# Altium schematic sheet Individual_Band.SchDoc
size A; SheetNumber: 2; SheetTotal: 4
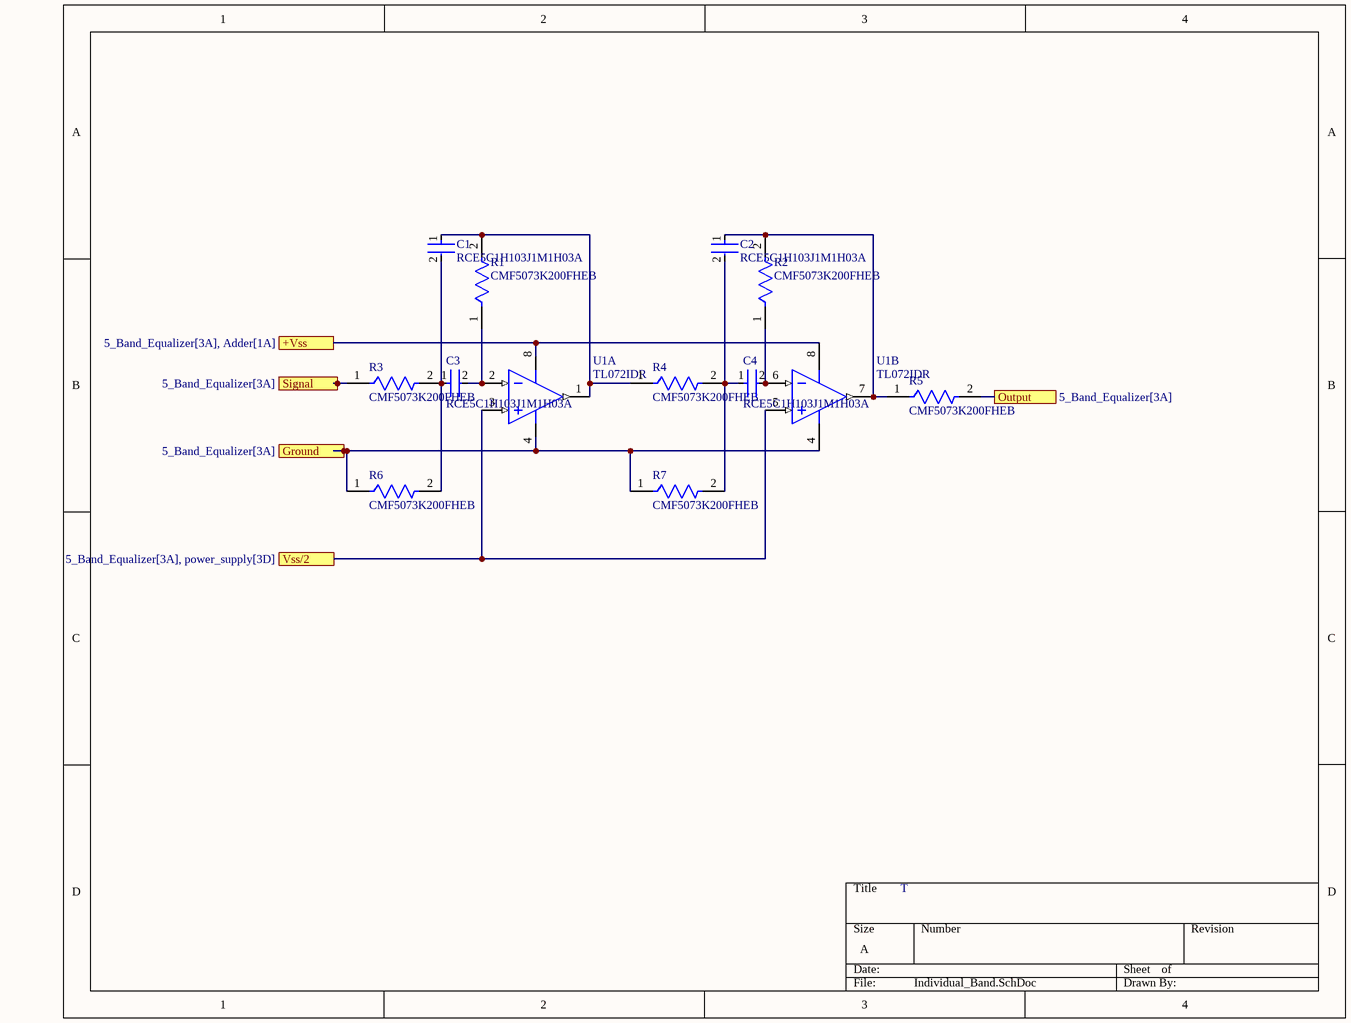
[diagram p0: Individual_Band.SchDoc]

## Parts
C1  RCE5C1H103J1M1H03A  [FP-RCE1K1-2_5-MFG]
C2  RCE5C1H103J1M1H03A  [FP-RCE1K1-2_5-MFG]
C3  RCE5C1H103J1M1H03A  [FP-RCE1K1-2_5-MFG]
C4  RCE5C1H103J1M1H03A  [FP-RCE1K1-2_5-MFG]
R1  CMF5073K200FHEB  [FP-CMF50-0]
R2  CMF5073K200FHEB  [FP-CMF50-0]
R3  CMF5073K200FHEB  [FP-CMF50-0]
R4  CMF5073K200FHEB  [FP-CMF50-0]
R5  CMF5073K200FHEB  [FP-CMF50-0]
R6  CMF5073K200FHEB  [FP-CMF50-0]
R7  CMF5073K200FHEB  [FP-CMF50-0]
U1  TL072IDR  [D0008A_L]  (parts A,B of 2)

## Ports
+Vss (see 5_Band_Equalizer[3A], Adder[1A]), Ground (see 5_Band_Equalizer[3A]), Output (see 5_Band_Equalizer[3A]), Signal (see 5_Band_Equalizer[3A]), Vss/2 (see 5_Band_Equalizer[3A], power_supply[3D])

## Nets
+Vss: U1.8(VCC+) ; port +Vss
Ground: R6.1 R7.1 U1.4(VCC-) ; port Ground
Output: R5.2 ; port Output
Signal: R3.1 ; port Signal
Vss/2: U1.3(IN1+) U1.5(IN2+) ; port Vss/2
NetC1_1: C1.1 R1.2 R4.1 U1.1(OUT1)
NetC1_2: C1.2 C3.1 R3.2 R6.2
NetC2_1: C2.1 R2.2 R5.1 U1.7(OUT2)
NetC2_2: C2.2 C4.1 R4.2 R7.2
NetC3_2: C3.2 R1.1 U1.2(IN1-)
NetC4_2: C4.2 R2.1 U1.6(IN2-)

## Notes on the sheet
- T

## Library data of the parts
C1-C4 = CMP-06035-061841-1: Cap Ceramic Monolithic 10nF 50V 5% Thru-Hole Bulk; Lead/Base Style: Formed Leads; Lead Diameter: 0.5mm; Dielectric: C0G; Height - Seated (Max): 0.138inch; Termination: Radial; Ratings: AEC-Q200; Width: 0.098inch; RoHS Compliant: Yes; Package Quantity: 2000; Voltage: 50V; Packaging: Tape and Reel; Voltage Rating (DC): 50V; Depth: 2.5mm; Tolerance: 5%; Voltage Rating: 50V; Length: 4mm; Capacitance: 10nF; Height: 3.5mm; Min Operating Temperature: -55°C; Max Operating Temperature: 125°C; Case/Package: Radial; Mount: Through Hole; Resistor Type: Ceramic; Lead Pitch: 0.197inch
R1-R7 = CMP-00030-44386654-1: CMF5073K200FHEB Res Metal Film 73.2K Ohm 1% 0.125W(1/8W) ±50ppm/°C Epoxy AXL T/R; Max Power Dissipation: 250mW; Voltage Rating: 200V; Power Rating: 125mW; Resistance: 73.2kΩ; Tolerance: 1%; Width: 1.65mm; Length: 3.81mm; Schedule B: 8533210090, 8533210090; Termination: Axial; Lead Free: Lead Free; Diameter: 1.65mm; Voltage Rating (DC): 200V; NexarPartId: 44386654; Packaging: Cut Tape; Max Operating Temperature: 175°C; Composition: Metal Film; RoHS: Compliant; Mount: Through Hole; Features: Flame Retardant Coating, Moisture Resistant; Number of Terminations: 2; Temperature Coefficient: 50ppm/°C; Min Operating Temperature: -55°C; Case/Package: Axial
U1 = CMP-0015-00084-2: Dual Low-Noise JFET-Input General-Purpose Operational Amplifier, 7 to 36 V, -40 to 85 degC, 8-pin SOIC (D8), Green (RoHS & no Sb/Br); Manufacturer: Texas Instruments; Number of Channels: 2; Rating: Catalog; IIB(Max)(pA): 200; Total Supply Voltage(Max)(+5V is 5, +/-5V is 10): 36; Vio (25C)(Max)(mV): 6; Iq per channel(Max)(mA): 2.5; Offset Drift(Typ)(uV/C): 18; Total Supply Voltage(Min)(+5V is 5, +/-5V is 10): 7; CMRR(Min)(dB): 75; Slew Rate(Typ)(V/us): 13; Sub Family: General Purpose Amplifier, High Supply Voltage Amplifier (>=30V); GBW(Typ)(MHz): 3; Code_JEDEC: MS-012; Eco-Plan: Green (RoHS & no Sb/Br); Mounting Technology: Surface Mount; ComponentLink3Description: Package Specification; PackageReference: D0008A; ComponentLink2URL: http://www.ti.com/lit/ds/symlink/tl072.pdf; ComponentLink1Description: Manufacturer URL; ComponentLink3URL: http://www.ti.com/litv/pdf/msoi002j; ComponentLink2Description: Datasheet; DatasheetVersion: SLOS080J; ComponentLink1URL: http://www.ti.com/; PackageDescription: 8-Pin Plastic Small Outline, Body 4.9 x 3.9 mm, Pitch 1.27 mm; PackageVersion: 4040047-3/M, 06/2011; Vn at 1kHz(Typ)(nV/rtHz): 18; PartNumber: TL072IDR